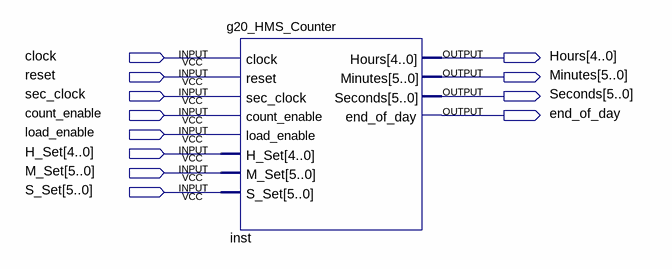
[diagram p0: schematic sheet]
// Quartus schematic g20_hms_counter.bdf as structural Verilog: 1 symbols, 12 pins
module g20_hms_counter (
  input  clock,
  input  reset,
  input  sec_clock,
  input  count_enable,
  input  load_enable,
  input  [4:0] H_Set,
  input  [5:0] M_Set,
  input  [5:0] S_Set,
  output [4:0] Hours,
  output [5:0] Minutes,
  output [5:0] Seconds,
  output end_of_day
);

  g20_HMS_Counter inst (
    .clock(clock), .reset(reset), .sec_clock(sec_clock), .count_enable(count_enable),
    .load_enable(load_enable), .H_Set(H_Set), .M_Set(M_Set), .S_Set(S_Set), .Hours(Hours), .Minutes(Minutes),
    .Seconds(Seconds), .end_of_day(end_of_day));
endmodule
